# Altium schematic sheet SENSOR_SCH.SchDoc
size A
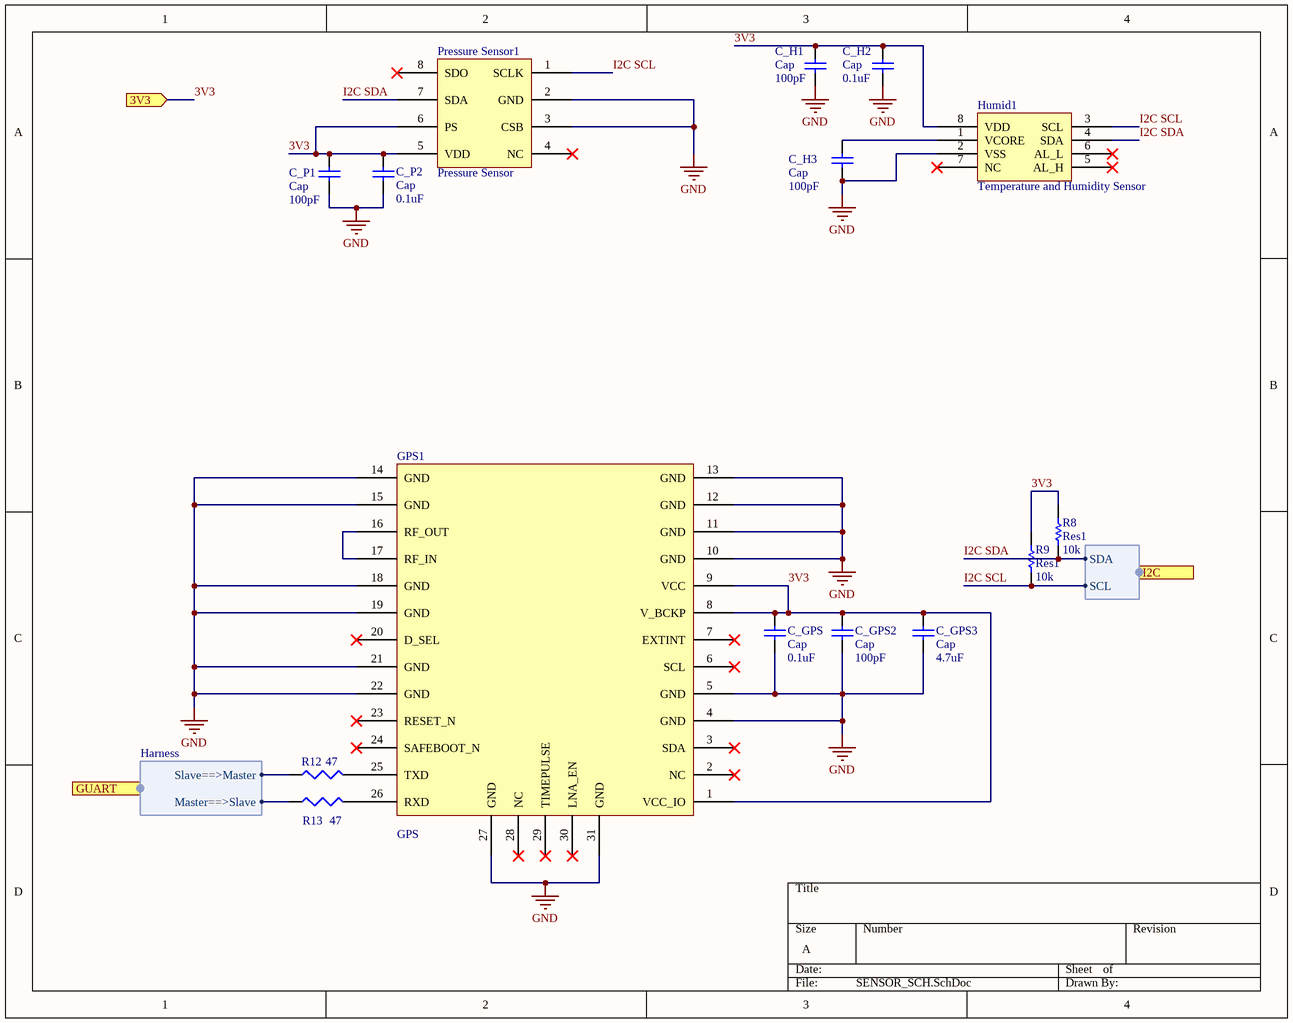
[diagram p0: SENSOR_SCH.SchDoc]

## Parts
C_GPS  Cap  value 0.1uF  [1608[0603]]
C_GPS2  Cap  value 100pF  [1608[0603]]
C_GPS3  Cap  value 4.7uF  [1608[0603]]
C_H1  Cap  value 100pF  [1608[0603]]
C_H2  Cap  value 0.1uF  [1608[0603]]
C_H3  Cap  value 100pF  [1608[0603]]
C_P1  Cap  value 100pF  [1608[0603]]
C_P2  Cap  value 0.1uF  [1608[0603]]
GPS1  GPS  [CAM M8C GPS]
Humid1  Temperature and Humidity Sensor  [Humidity Sensor]
Pressure_Sensor1  Pressure Sensor  [Pressure Sensor]
R8  Res1  value 10k  [J1-0603]
R9  Res1  value 10k  [J1-0603]
R12  value 47  [J1-0603]  (hidden comment: Res3)
R13  value 47  [J1-0603]  (hidden comment: Res3)

## Ports
3V3 (in), GUART (harness Harness), I2C (harness I2C)

## Harnesses
Harness: Slave==>Master, Master==>Slave
I2C: SDA, SCL

## Nets
GND: C_GPS.1 C_GPS2.1 C_GPS3.1 C_H1.1 C_H2.1 C_H3.1 C_P1.1 C_P2.1 GPS1.4(GND) GPS1.5(GND) GPS1.10(GND) GPS1.11(GND) GPS1.12(GND) GPS1.13(GND) GPS1.14(GND) GPS1.15(GND) GPS1.18(GND) GPS1.19(GND) GPS1.21(GND) GPS1.22(GND) GPS1.27(GND) GPS1.31(GND) Humid1.2(VSS) Pressure_Sensor1.2(GND) Pressure_Sensor1.3(CSB)
3V3: C_GPS.2 C_GPS2.2 C_GPS3.2 C_H1.2 C_H2.2 C_P1.2 C_P2.2 GPS1.1(VCC_IO) GPS1.8(V_BCKP) GPS1.9(VCC) Humid1.8(VDD) Pressure_Sensor1.5(VDD) Pressure_Sensor1.6(PS) R8.2 R9.2 ; port 3V3
I2C SCL: Humid1.3(SCL) Pressure_Sensor1.1(SCLK) R9.1 ; port I2C.SCL
I2C SDA: Humid1.4(SDA) Pressure_Sensor1.7(SDA) R8.1 ; port I2C.SDA
NetC_H3_2: C_H3.2 Humid1.1(VCORE)
NetGPS1_16: GPS1.16(RF_OUT) GPS1.17(RF_IN)
NetGPS1_25: GPS1.25(TXD) R12.2
NetGPS1_26: GPS1.26(RXD) R13.2
NetR12_1: R12.1 ; port GUART.Slave==>Master
NetR13_1: R13.1 ; port GUART.Master==>Slave

Not connected (* = marked no-connect by the designer): GPS1 2(NC)* 3(SDA)* 6(SCL)* 7(EXTINT)* 20(D_SEL)* 23(RESET_N)* 24(SAFEBOOT_N)* 28(NC)* 29(TIMEPULSE)* 30(LNA_EN)*; Humid1 5(AL_H)* 6(AL_L)* 7(NC)*; Pressure_Sensor1 4(NC)* 8(SDO)*

## Library data of the parts
C_GPS C_GPS2 C_GPS3 C_H1-C_H3 C_P1 C_P2 = Cap: Capacitor; Published: 8-Jun-2000; LatestRevisionDate: 17-Jul-2002; LatestRevisionNote: Re-released for DXP Platform.; PackageReference: RAD-0.3; Publisher: Altium Limited; PackageDescription: Radial Cap, Thru-Hole; 2 Leads; 0.3 in Pin Spacing
GPS1 = GPS: CAM M8C
Humid1 = Temperature and Humidity Sensor: HIH6030-021-001
Pressure_Sensor1 = Pressure Sensor: MS580301BA01-00
R8 R9 = Res1: Resistor; Published: 8-Jun-2000; LatestRevisionDate: 17-Jul-2002; LatestRevisionNote: Re-released for DXP Platform.; PackageReference: AXIAL-0.3; Publisher: Altium Limited; PackageDescription: Axial Device, Thru-Hole; 2 Leads; 0.3 in Pin Spacing
R12 R13 = Res3: Resistor; Published: 8-Jun-2000; LatestRevisionDate: 29-May-2009; LatestRevisionNote: IPC-7351 Footprint Added.; PackageReference: J1-0603; Publisher: Altium Limited; PackageDescription: Chip Resistor